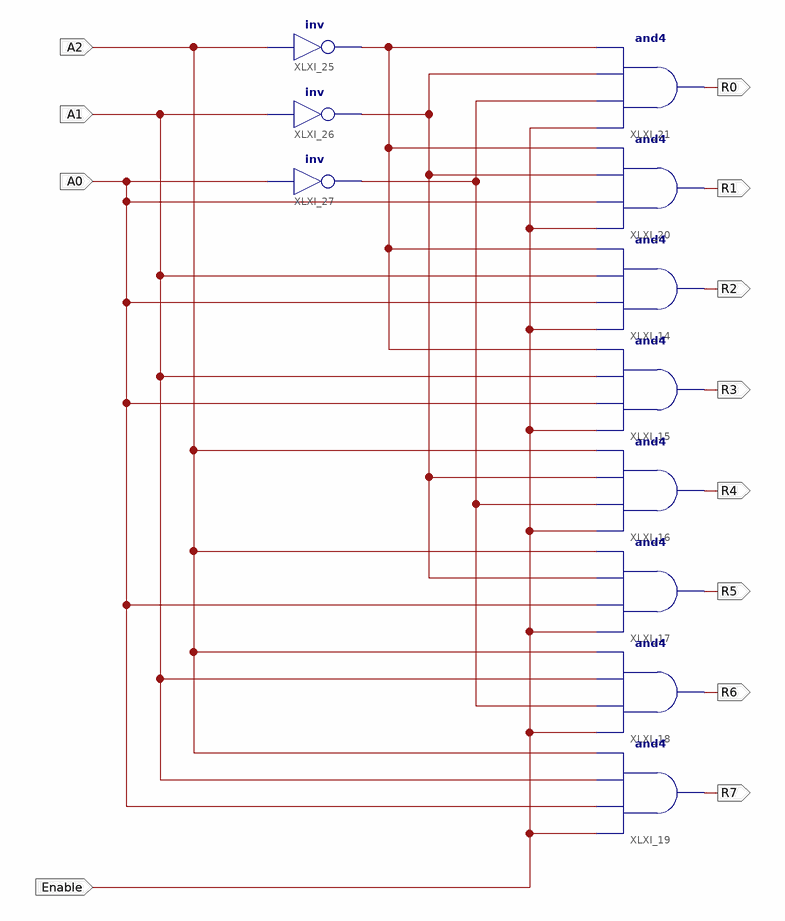
[diagram p0: schematic sheet 1]
// Xilinx ISE schematic decoder_3t08.sch (spartan3e) as structural Verilog: 11 symbols, 12 ports
module decoder_3t08 (
  input  A2,
  input  A1,
  input  A0,
  input  Enable,
  output R0,
  output R1,
  output R2,
  output R3,
  output R4,
  output R5,
  output R6,
  output R7
);

  wire XLXN_85, XLXN_86, XLXN_87;

  not XLXI_25 (XLXN_87, A2);
  not XLXI_26 (XLXN_86, A1);
  not XLXI_27 (XLXN_85, A0);
  and XLXI_14 (R2, Enable, A0, A1, XLXN_87);
  and XLXI_15 (R3, Enable, A0, A1, XLXN_87);
  and XLXI_16 (R4, Enable, XLXN_85, XLXN_86, A2);
  and XLXI_17 (R5, Enable, A0, XLXN_86, A2);
  and XLXI_18 (R6, Enable, XLXN_85, A1, A2);
  and XLXI_20 (R1, Enable, A0, XLXN_86, XLXN_87);
  and XLXI_21 (R0, Enable, XLXN_85, XLXN_86, XLXN_87);
  and XLXI_19 (R7, Enable, A0, A1, A2);
endmodule
